# Altium schematic sheet GSM IoT Block Diagram.SchDoc: GSM IoT Block Diagram
size 292 x 193 mm; DocumentNumber: 9; SheetNumber: 24; SheetTotal: 38
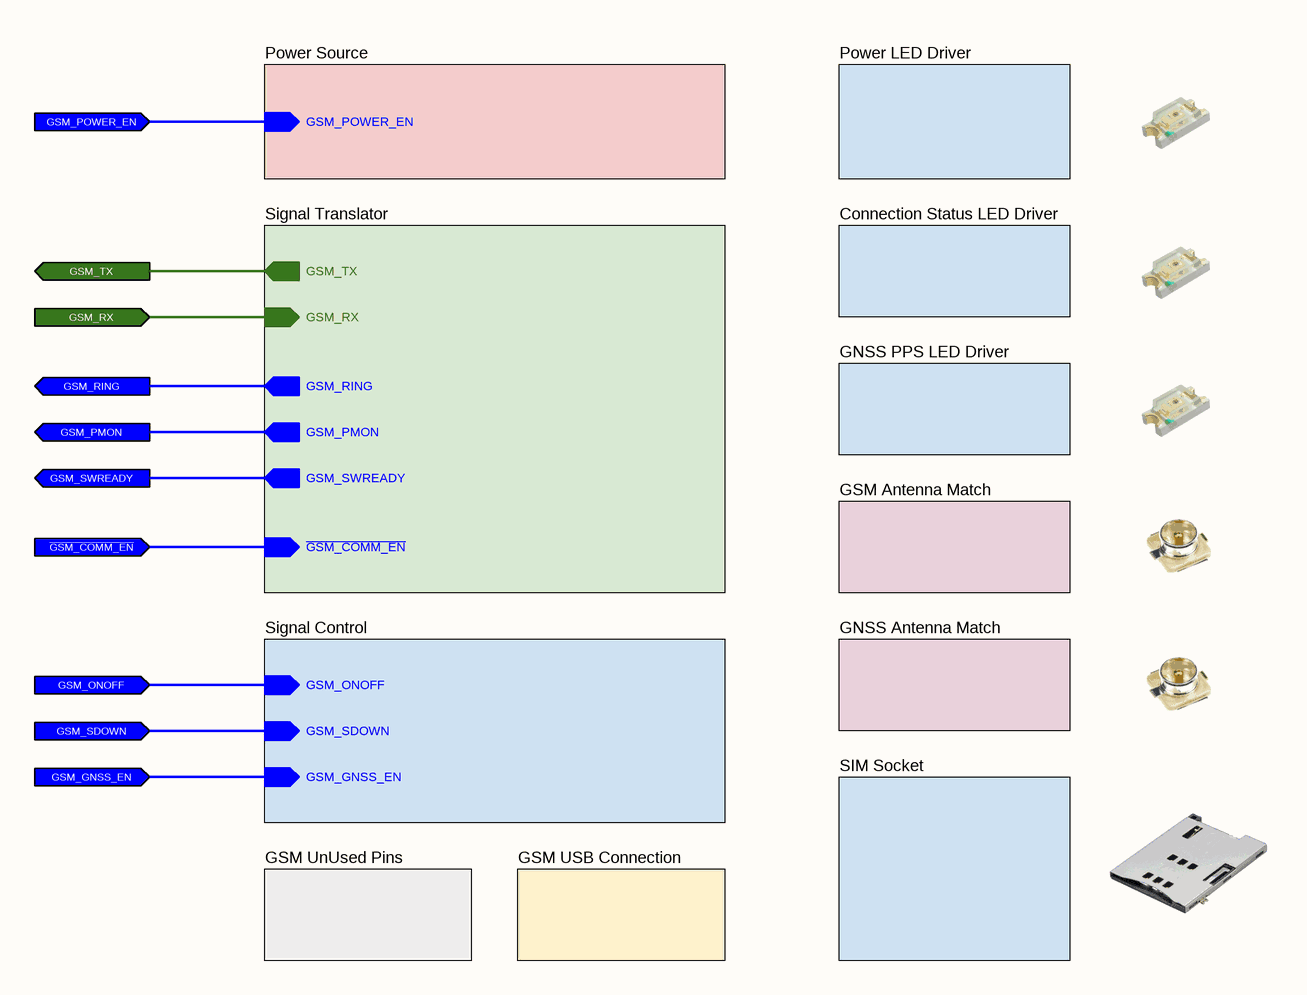
[diagram p0: GSM IoT Block Diagram.SchDoc]

## Sub-sheets
Connection Status LED Driver = GSM Status LED Driver.SchDoc: no entries
GNSS Antenna Match = GNSS Antenna.SchDoc: no entries
GNSS PPS LED Driver = GSM PPS LED Driver.SchDoc: no entries
GSM Antenna Match = GSM Modem Antenna.SchDoc: no entries
GSM UnUsed Pins = GSM UnUsed.SchDoc: no entries
GSM USB Connection = GSM USB Port.SchDoc: no entries
Power LED Driver = GSM Power LED Driver.SchDoc: no entries
Power Source = GSM Power Source.SchDoc: GSM_POWER_EN (in)
Signal Control = GSM Signal Block Diagram.SchDoc: GSM_ONOFF (in), GSM_SDOWN (in), GSM_GNSS_EN (in)
Signal Translator = GSM Voltage Translator.SchDoc: ~{GSM_COMM_EN} (in), GSM_RX (in), GSM_PMON (out), GSM_RING (out), GSM_TX (out), GSM_SWREADY (out)
SIM Socket = GSM SIM Socket.SchDoc: no entries

## Ports
GSM_GNSS_EN (in), GSM_ONOFF (in), GSM_PMON (out), GSM_POWER_EN (in), GSM_RING (out), GSM_RX (in), GSM_SDOWN (in), GSM_SWREADY (out), GSM_TX (out), ~{GSM_COMM_EN} (in)

## Nets
~{GSM_COMM_EN}: port ~{GSM_COMM_EN}, sheet Signal Translator/~{GSM_COMM_EN}
GSM_GNSS_EN: port GSM_GNSS_EN, sheet Signal Control/GSM_GNSS_EN
GSM_ONOFF: port GSM_ONOFF, sheet Signal Control/GSM_ONOFF
GSM_PMON: port GSM_PMON, sheet Signal Translator/GSM_PMON
GSM_POWER_EN: port GSM_POWER_EN, sheet Power Source/GSM_POWER_EN
GSM_RING: port GSM_RING, sheet Signal Translator/GSM_RING
GSM_RX: port GSM_RX, sheet Signal Translator/GSM_RX
GSM_SDOWN: port GSM_SDOWN, sheet Signal Control/GSM_SDOWN
GSM_SWREADY: port GSM_SWREADY, sheet Signal Translator/GSM_SWREADY
GSM_TX: port GSM_TX, sheet Signal Translator/GSM_TX

## Notes on the sheet
- © 2021 All rights reserved.
  This document may not, in whole or in part, be copied, photocopied, reproduced, translated or converted to any electronic or machine readable from without prior written permission of Mehmet Günce Akkoyun.
  Engineer contact : akkoyun@me.com
- Property of
- Engineer :
- Date :
- Size :
- A4
- Time :
- Project :
- Page :
- /
- Customer :
- Product ID :
- Module ID :
- Version :
- File :
- Revision :